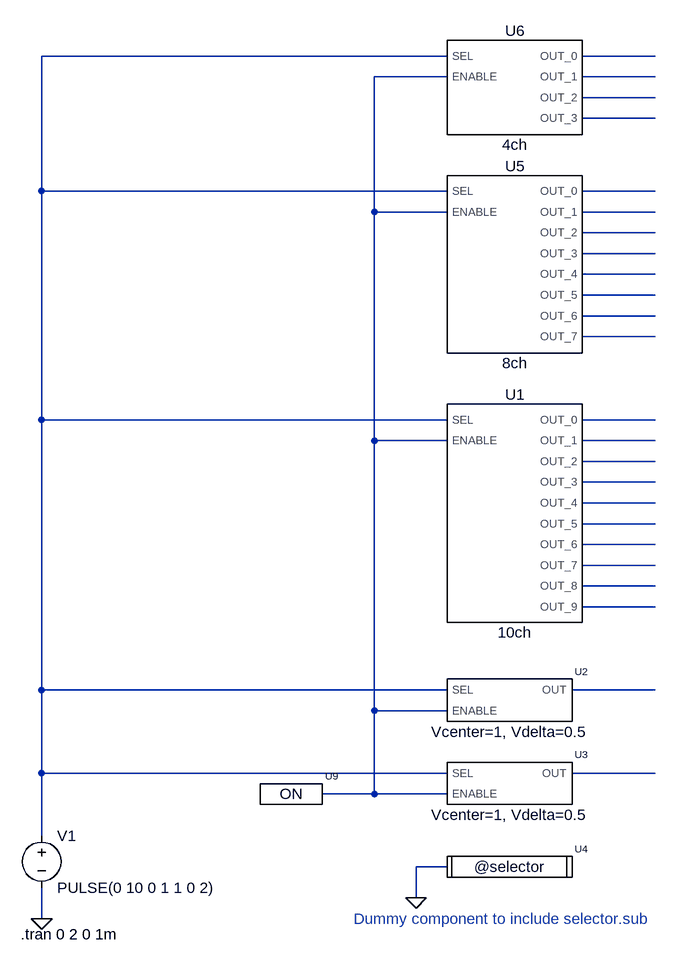
[diagram p0: schematic decoder.test.asc]
decoder.test.asc, the LTspice schematic file:
Version 4
SHEET 1 1560 680
WIRE 576 -928 -48 -928
WIRE 896 -928 784 -928
WIRE 576 -896 464 -896
WIRE 896 -896 784 -896
WIRE 896 -864 784 -864
WIRE 896 -832 784 -832
WIRE -48 -720 -48 -928
WIRE 576 -720 -48 -720
WIRE 896 -720 784 -720
WIRE 464 -688 464 -896
WIRE 576 -688 464 -688
WIRE 896 -688 784 -688
WIRE 896 -656 784 -656
WIRE 896 -624 784 -624
WIRE 896 -592 784 -592
WIRE 896 -560 784 -560
WIRE 896 -528 784 -528
WIRE 896 -496 784 -496
WIRE -48 -368 -48 -720
WIRE 576 -368 -48 -368
WIRE 896 -368 784 -368
WIRE 464 -336 464 -688
WIRE 576 -336 464 -336
WIRE 896 -336 784 -336
WIRE 896 -304 784 -304
WIRE 896 -272 784 -272
WIRE 896 -240 784 -240
WIRE 896 -208 784 -208
WIRE 896 -176 784 -176
WIRE 896 -144 784 -144
WIRE 896 -112 784 -112
WIRE 896 -80 784 -80
WIRE -48 48 -48 -368
WIRE 576 48 -48 48
WIRE 896 48 768 48
WIRE 464 80 464 -336
WIRE 576 80 464 80
WIRE -48 176 -48 48
WIRE 576 176 -48 176
WIRE 896 176 768 176
WIRE 464 208 464 80
WIRE 464 208 384 208
WIRE 576 208 464 208
WIRE -48 272 -48 176
WIRE 576 320 528 320
WIRE 528 368 528 320
WIRE -48 400 -48 352
FLAG -48 400 0
FLAG 528 368 0
SYMBOL voltage -48 256 R0
WINDOW 123 0 0 Left 2
WINDOW 39 0 0 Left 2
SYMATTR InstName V1
SYMATTR Value PULSE(0 10 0 1 1 0 2)
SYMBOL decoder-on 336 208 R0
SYMATTR InstName U9
SYMBOL decoder-10ch 672 -224 R0
SYMATTR InstName U1
SYMBOL decoder-element 672 64 R0
SYMATTR InstName U2
SYMBOL decoder-element 672 192 R0
SYMATTR InstName U3
SYMBOL @decoder 672 320 R0
SYMATTR InstName U4
SYMBOL decoder-8ch 672 -608 R0
SYMATTR InstName U5
SYMBOL decoder-4ch 672 -880 R0
SYMATTR InstName U6
TEXT -80 424 Left 2 !.tran 0 2 0 1m
TEXT 432 400 Left 2 ;Dummy component to include selector.sub

The netlist it stands for:
* decoder.test.asc
V1 N001 0 PULSE(0 10 0 1 1 0 2)
XU9 N003 decoder-on  ; pins OUT
XU1 N001 N003 N015 N016 N017 N018 N019 N020 N021 N022 N023 N024 decoder-10ch  ; pins SEL ENABLE OUT_0 OUT_1 OUT_2 OUT_3 OUT_4 OUT_5 OUT_6 OUT_7 OUT_8 OUT_9
XU2 N001 N003 N025 decoder-element Vcenter=1, Vdelta=0.5  ; pins SEL ENABLE OUT
XU3 N001 N003 N026 decoder-element Vcenter=1, Vdelta=0.5  ; pins SEL ENABLE OUT
XU4 0 @decoder
XU5 N001 N003 N007 N008 N009 N010 N011 N012 N013 N014 decoder-8ch  ; pins SEL ENABLE OUT_0 OUT_1 OUT_2 OUT_3 OUT_4 OUT_5 OUT_6 OUT_7
XU6 N001 N003 N002 N004 N005 N006 decoder-4ch  ; pins SEL ENABLE OUT_0 OUT_1 OUT_2 OUT_3
.tran 0 2 0 1m
* Dummy component to include selector.sub
.lib decoder.sub
.lib decoder-impl.sub
.backanno
.end